# Altium schematic sheet 08_Connectors_STM32_A.SchDoc
size A; SheetNumber: 8; SheetTotal: 9
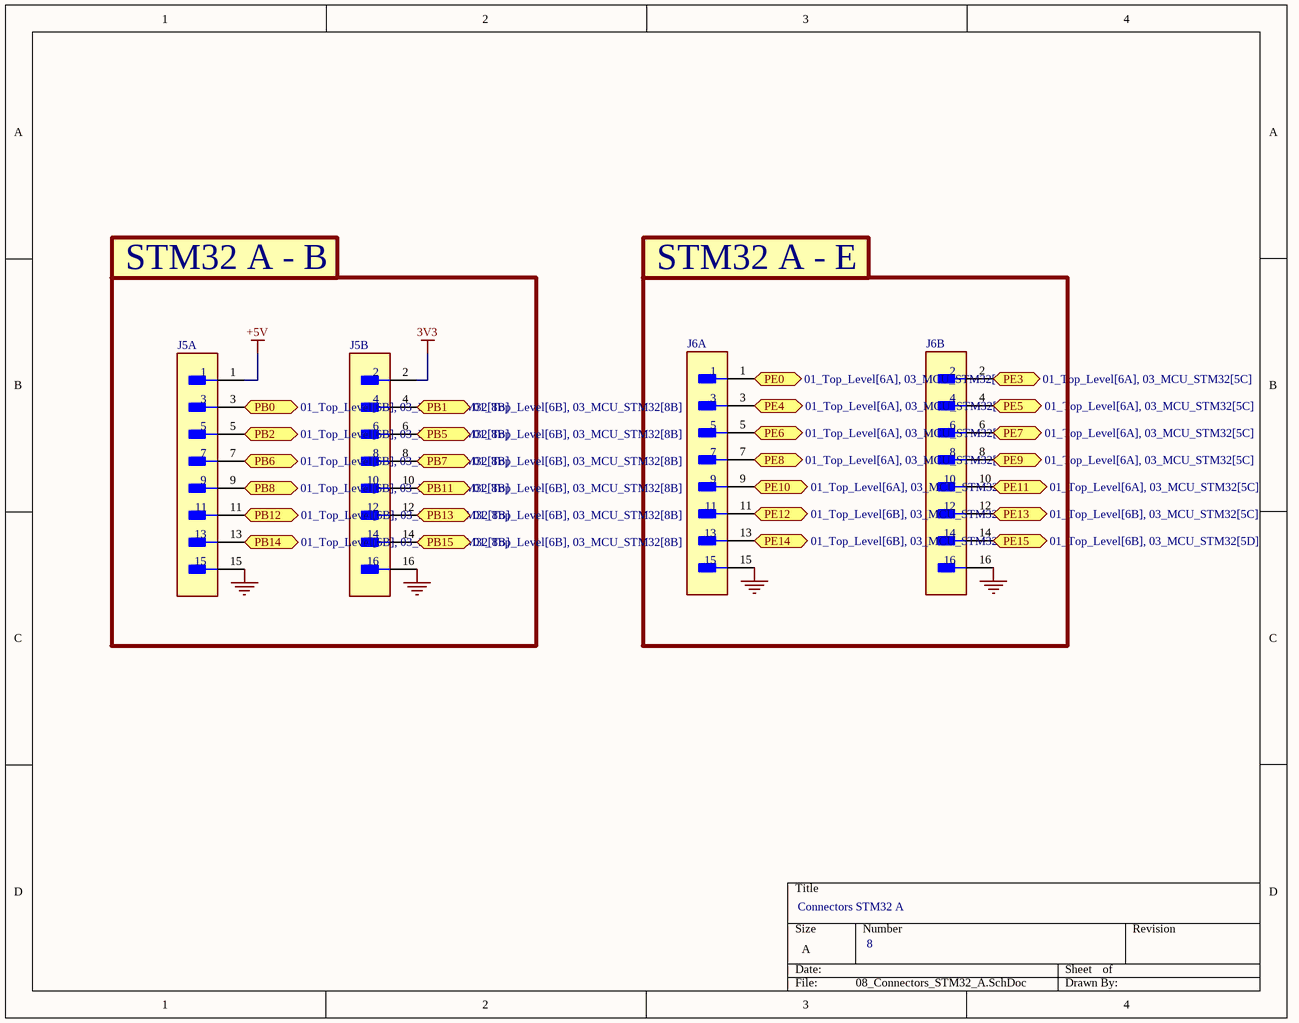
[diagram p0: 08_Connectors_STM32_A.SchDoc]

## Parts
J5  GRPB082MWCN-RC  [FP-GRPB082MWCN-RC-MFG]  (value not drawn)  (parts A,B of 2)
J6  GRPB082MWCN-RC  [FP-GRPB082MWCN-RC-MFG]  (value not drawn)  (parts A,B of 2)

## Blocks framed on the sheet
STM32 A - B: J5
STM32 A - E: J6

## Ports
PB0 (bidir, see 01_Top_Level[6B], 03_MCU_STM32[8B]), PB1 (bidir, see 01_Top_Level[6B], 03_MCU_STM32[8B]), PB2 (bidir, see 01_Top_Level[6B], 03_MCU_STM32[8B]), PB5 (bidir, see 01_Top_Level[6B], 03_MCU_STM32[8B]), PB6 (bidir, see 01_Top_Level[6B], 03_MCU_STM32[8B]), PB7 (bidir, see 01_Top_Level[6B], 03_MCU_STM32[8B]), PB8 (bidir, see 01_Top_Level[6B], 03_MCU_STM32[8B]), PB11 (bidir, see 01_Top_Level[6B], 03_MCU_STM32[8B]), PB12 (bidir, see 01_Top_Level[6B], 03_MCU_STM32[8B]), PB13 (bidir, see 01_Top_Level[6B], 03_MCU_STM32[8B]), PB14 (bidir, see 01_Top_Level[6B], 03_MCU_STM32[8B]), PB15 (bidir, see 01_Top_Level[6B], 03_MCU_STM32[8B]), PE0 (bidir, see 01_Top_Level[6A], 03_MCU_STM32[5C]), PE3 (bidir, see 01_Top_Level[6A], 03_MCU_STM32[5C]), PE4 (bidir, see 01_Top_Level[6A], 03_MCU_STM32[5C]), PE5 (bidir, see 01_Top_Level[6A], 03_MCU_STM32[5C]), PE6 (bidir, see 01_Top_Level[6A], 03_MCU_STM32[5C]), PE7 (bidir, see 01_Top_Level[6A], 03_MCU_STM32[5C]), PE8 (bidir, see 01_Top_Level[6A], 03_MCU_STM32[5C]), PE9 (bidir, see 01_Top_Level[6A], 03_MCU_STM32[5C]), PE10 (bidir, see 01_Top_Level[6A], 03_MCU_STM32[5C]), PE11 (bidir, see 01_Top_Level[6A], 03_MCU_STM32[5C]), PE12 (bidir, see 01_Top_Level[6B], 03_MCU_STM32[5C]), PE13 (bidir, see 01_Top_Level[6B], 03_MCU_STM32[5C]), PE14 (bidir, see 01_Top_Level[6B], 03_MCU_STM32[5C]), PE15 (bidir, see 01_Top_Level[6B], 03_MCU_STM32[5D])

## Nets
3V3: J5.2
+5V: J5.1
GND: J5.15 J5.16 J6.15 J6.16
PB0: J5.3 ; port PB0
PB1: J5.4 ; port PB1
PB2: J5.5 ; port PB2
PB5: J5.6 ; port PB5
PB6: J5.7 ; port PB6
PB7: J5.8 ; port PB7
PB8: J5.9 ; port PB8
PB11: J5.10 ; port PB11
PB12: J5.11 ; port PB12
PB13: J5.12 ; port PB13
PB14: J5.13 ; port PB14
PB15: J5.14 ; port PB15
PE0: J6.1 ; port PE0
PE3: J6.2 ; port PE3
PE4: J6.3 ; port PE4
PE5: J6.4 ; port PE5
PE6: J6.5 ; port PE6
PE7: J6.6 ; port PE7
PE8: J6.7 ; port PE8
PE9: J6.8 ; port PE9
PE10: J6.9 ; port PE10
PE11: J6.10 ; port PE11
PE12: J6.11 ; port PE12
PE13: J6.12 ; port PE13
PE14: J6.13 ; port PE14
PE15: J6.14 ; port PE15

## Notes on the sheet
- Connectors STM32 A
- 8

## Library data of the parts
J5 J6 = CMP-25680-000081-1: CONN HEADER R/A 16POS 1.27MM; Number of Positions: 16; Row Spacing: 0.05inch; Max Operating Temperature: 105°C; Flammability Rating: UL94 V-0; Contact Type: Male Pin; Termination: Solder; Contact Material: Brass; Package Quantity: 1; Lead Free: Lead Free; Min Operating Temperature: -40°C; Contact Shape: Square; Insulation Material: Nylon; Contact Plating: Gold; Connector Type: Header; Mount: Through Hole; Pitch: 1.27mm; RoHS Compliant: Yes; Fastening Type: Pull; Number of Rows: 2; Contact Mating Length: 0.118inch; Series: -; Packaging: Bulk; Contact Finish - Mating: GOLD